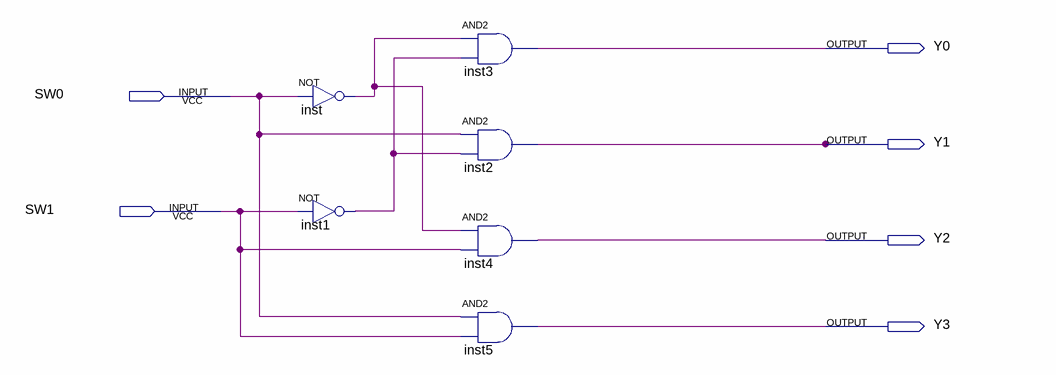
[diagram p0: schematic sheet]
// Quartus schematic Decoder.bdf as structural Verilog: 6 symbols, 6 pins
module Decoder (
  input  SW0,
  input  SW1,
  output Y0,
  output Y1,
  output Y2,
  output Y3
);

  wire inst1_out, inst_out;

  not inst (inst_out, SW0);
  not inst1 (inst1_out, SW1);
  and inst3 (Y0, inst_out, inst1_out);
  and inst2 (Y1, SW0, inst1_out);
  and inst4 (Y2, inst_out, SW1);
  and inst5 (Y3, SW0, SW1);
endmodule
